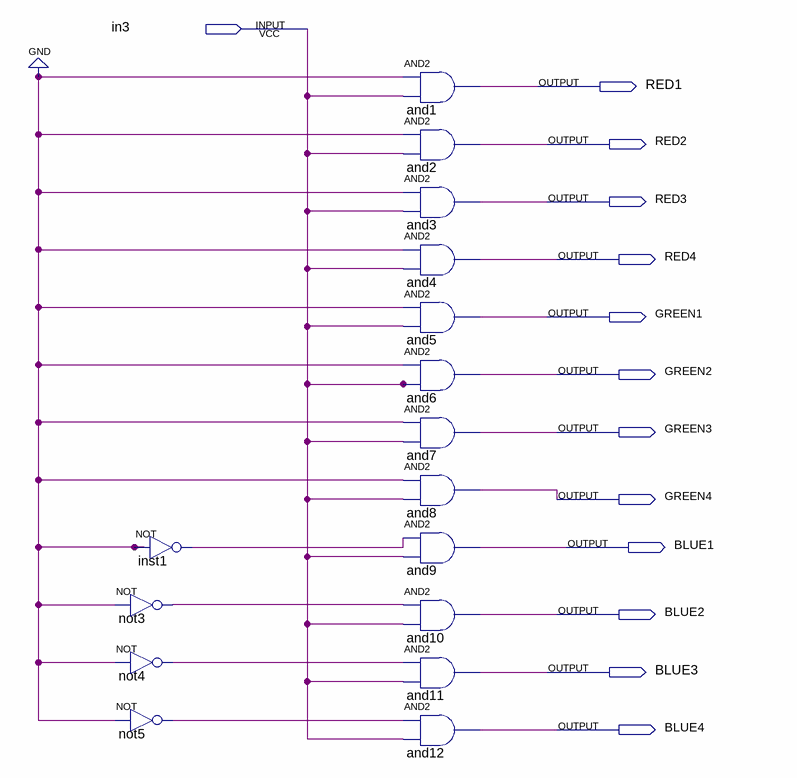
[diagram p0: schematic sheet]
// Quartus schematic blue.bdf as structural Verilog: 16 symbols, 13 pins
module blue (
  input  in3,
  output RED1,
  output RED2,
  output RED3,
  output RED4,
  output GREEN1,
  output GREEN2,
  output GREEN3,
  output GREEN4,
  output BLUE1,
  output BLUE2,
  output BLUE3,
  output BLUE4
);

  wire inst1_out, not3_out, not4_out, not5_out;

  not inst1 (inst1_out, 1'b0);
  not not3 (not3_out, 1'b0);
  not not4 (not4_out, 1'b0);
  not not5 (not5_out, 1'b0);
  and and1 (RED1, 1'b0, in3);
  and and2 (RED2, 1'b0, in3);
  and and3 (RED3, 1'b0, in3);
  and and4 (RED4, 1'b0, in3);
  and and5 (GREEN1, 1'b0, in3);
  and and6 (GREEN2, 1'b0, in3);
  and and7 (GREEN3, 1'b0, in3);
  and and8 (GREEN4, 1'b0, in3);
  and and9 (BLUE1, inst1_out, in3);
  and and10 (BLUE2, not3_out, in3);
  and and11 (BLUE3, not4_out, in3);
  and and12 (BLUE4, not5_out, in3);
endmodule
